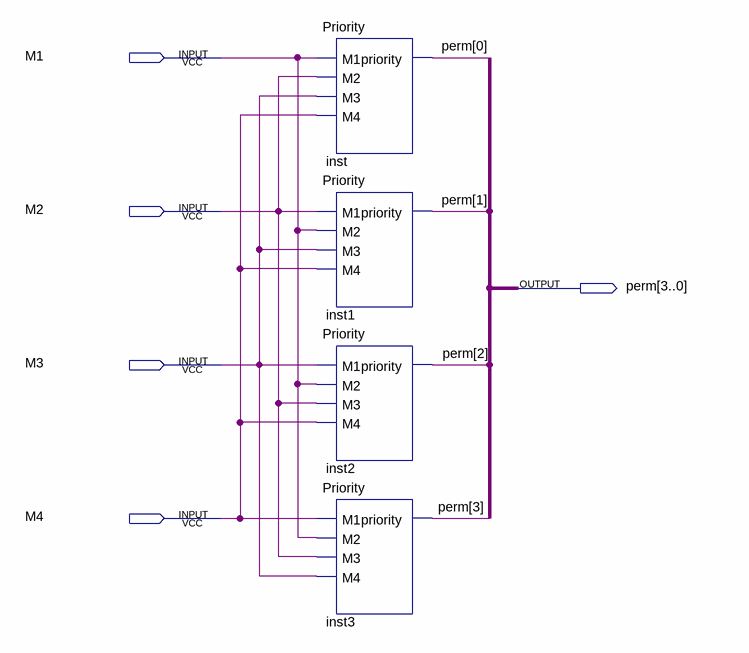
[diagram p0: schematic sheet]
// Quartus schematic M_Choise.bdf as structural Verilog: 4 symbols, 5 pins
module M_Choise (
  input  M1,
  input  M2,
  input  M3,
  input  M4,
  output [3:0] perm
);

  Priority inst (.M1(M1), .M2(M2), .M3(M3), .M4(M4), .\priority (perm[0]));
  Priority inst1 (.M1(M2), .M2(M1), .M3(M3), .M4(M4), .\priority (perm[1]));
  Priority inst2 (.M1(M3), .M2(M1), .M3(M2), .M4(M4), .\priority (perm[2]));
  Priority inst3 (.M1(M4), .M2(M1), .M3(M2), .M4(M3), .\priority (perm[3]));
endmodule
